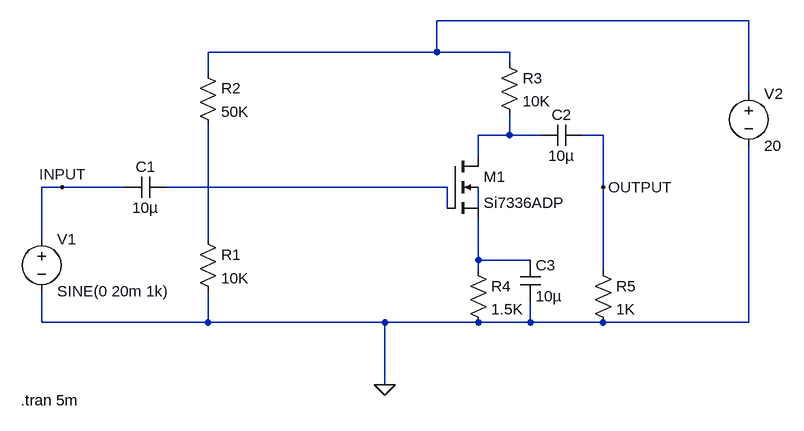
[diagram p0: schematic mosfet.asc]
mosfet.asc, the LTspice schematic file:
Version 4
SHEET 1 880 680
WIRE 624 -112 144 -112
WIRE 144 -64 144 -112
WIRE 144 -64 -208 -64
WIRE 256 -64 144 -64
WIRE 256 -48 256 -64
WIRE -208 -32 -208 -64
WIRE 624 0 624 -112
WIRE 256 64 256 32
WIRE 256 64 208 64
WIRE 304 64 256 64
WIRE 400 64 368 64
WIRE 208 96 208 64
WIRE -432 144 -464 144
WIRE -336 144 -432 144
WIRE 160 144 -272 144
WIRE 400 144 400 64
WIRE 160 176 160 144
WIRE 208 176 208 144
WIRE -464 224 -464 144
WIRE -208 224 -208 48
WIRE 208 256 208 192
WIRE 288 256 208 256
WIRE 208 272 208 256
WIRE 400 272 400 144
WIRE -464 352 -464 304
WIRE -208 352 -208 304
WIRE -208 352 -464 352
WIRE 64 352 -208 352
WIRE 208 352 64 352
WIRE 288 352 288 320
WIRE 288 352 208 352
WIRE 400 352 288 352
WIRE 624 352 624 80
WIRE 624 352 400 352
WIRE 64 448 64 352
FLAG 64 448 0
FLAG -432 144 INPUT
FLAG 400 144 OUTPUT
SYMBOL cap -272 128 R90
WINDOW 0 0 32 VBottom 2
WINDOW 3 32 32 VTop 2
SYMATTR InstName C1
SYMATTR Value 10µ
SYMBOL cap 368 48 R90
WINDOW 0 0 32 VBottom 2
WINDOW 3 32 32 VTop 2
SYMATTR InstName C2
SYMATTR Value 10µ
SYMBOL voltage 624 -16 R0
WINDOW 123 0 0 Left 0
WINDOW 39 0 0 Left 0
SYMATTR InstName V2
SYMATTR Value 20
SYMBOL voltage -464 208 R0
WINDOW 123 0 0 Left 0
WINDOW 39 0 0 Left 0
SYMATTR InstName V1
SYMATTR Value SINE(0 20m 1k)
SYMBOL nmos4 160 96 R0
SYMATTR InstName M1
SYMATTR Value Si7336ADP
SYMBOL res -224 208 R0
SYMATTR InstName R1
SYMATTR Value 10K
SYMBOL res -224 -48 R0
SYMATTR InstName R2
SYMATTR Value 50K
SYMBOL res 240 -64 R0
SYMATTR InstName R3
SYMATTR Value 10K
SYMBOL res 192 256 R0
SYMATTR InstName R4
SYMATTR Value 1.5K
SYMBOL res 384 256 R0
SYMATTR InstName R5
SYMATTR Value 1K
SYMBOL cap 272 256 R0
SYMATTR InstName C3
SYMATTR Value 10µ
TEXT -496 472 Left 2 !.tran 5m

The netlist it stands for:
* mosfet.asc
C1 N003 INPUT 10µ
C2 OUTPUT N002 10µ
V2 N001 0 20
V1 INPUT 0 SINE(0 20m 1k)
M1 N002 N003 N006 N004 Si7336ADP
R1 N005 0 10K
R2 N001 N005 50K
R3 N001 N002 10K
R4 N006 0 1.5K
R5 OUTPUT 0 1K
C3 N006 0 10µ
.model NMOS NMOS
.model PMOS PMOS
.lib standard.mos
.tran 5m
.backanno
.end